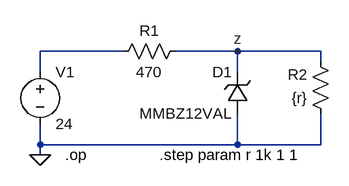
[diagram p0: schematic DE_2025_ZENER_CARGA_VARIABLE.asc]
DE_2025_ZENER_CARGA_VARIABLE.asc, the LTspice schematic file:
Version 4
SHEET 1 880 680
WIRE 144 112 16 112
WIRE 320 112 224 112
WIRE 448 112 320 112
WIRE 448 128 448 112
WIRE 16 144 16 112
WIRE 320 144 320 112
WIRE 16 256 16 224
WIRE 320 256 320 208
WIRE 320 256 16 256
WIRE 448 256 448 208
WIRE 448 256 320 256
WIRE 16 272 16 256
FLAG 16 272 0
FLAG 320 112 z
SYMBOL zener 336 208 R180
WINDOW 0 24 64 Left 2
WINDOW 3 24 0 Left 2
SYMATTR InstName D1
SYMATTR Value MMBZ12VAL
SYMBOL res 240 96 R90
WINDOW 0 0 56 VBottom 2
WINDOW 3 32 56 VTop 2
SYMATTR InstName R1
SYMATTR Value 470
SYMBOL res 464 224 R180
WINDOW 0 36 76 Left 2
WINDOW 3 36 40 Left 2
SYMATTR InstName R2
SYMATTR Value {r}
SYMBOL voltage 16 128 R0
SYMATTR InstName V1
SYMATTR Value 24
TEXT 54 272 Left 2 !.op
TEXT 200 272 Left 2 !.step param r 1k 1 1

The netlist it stands for:
* DE_2025_ZENER_CARGA_VARIABLE.asc
D1 0 z MMBZ12VAL
R1 z N001 470
R2 0 z {r}
V1 N001 0 24
.model D D
.lib standard.dio
.op
.step param r 1k 1 1
.backanno
.end